# Altium schematic sheet RS232&IrDA.SchDoc
size A4; Revision: B.1(PCB.SCH)
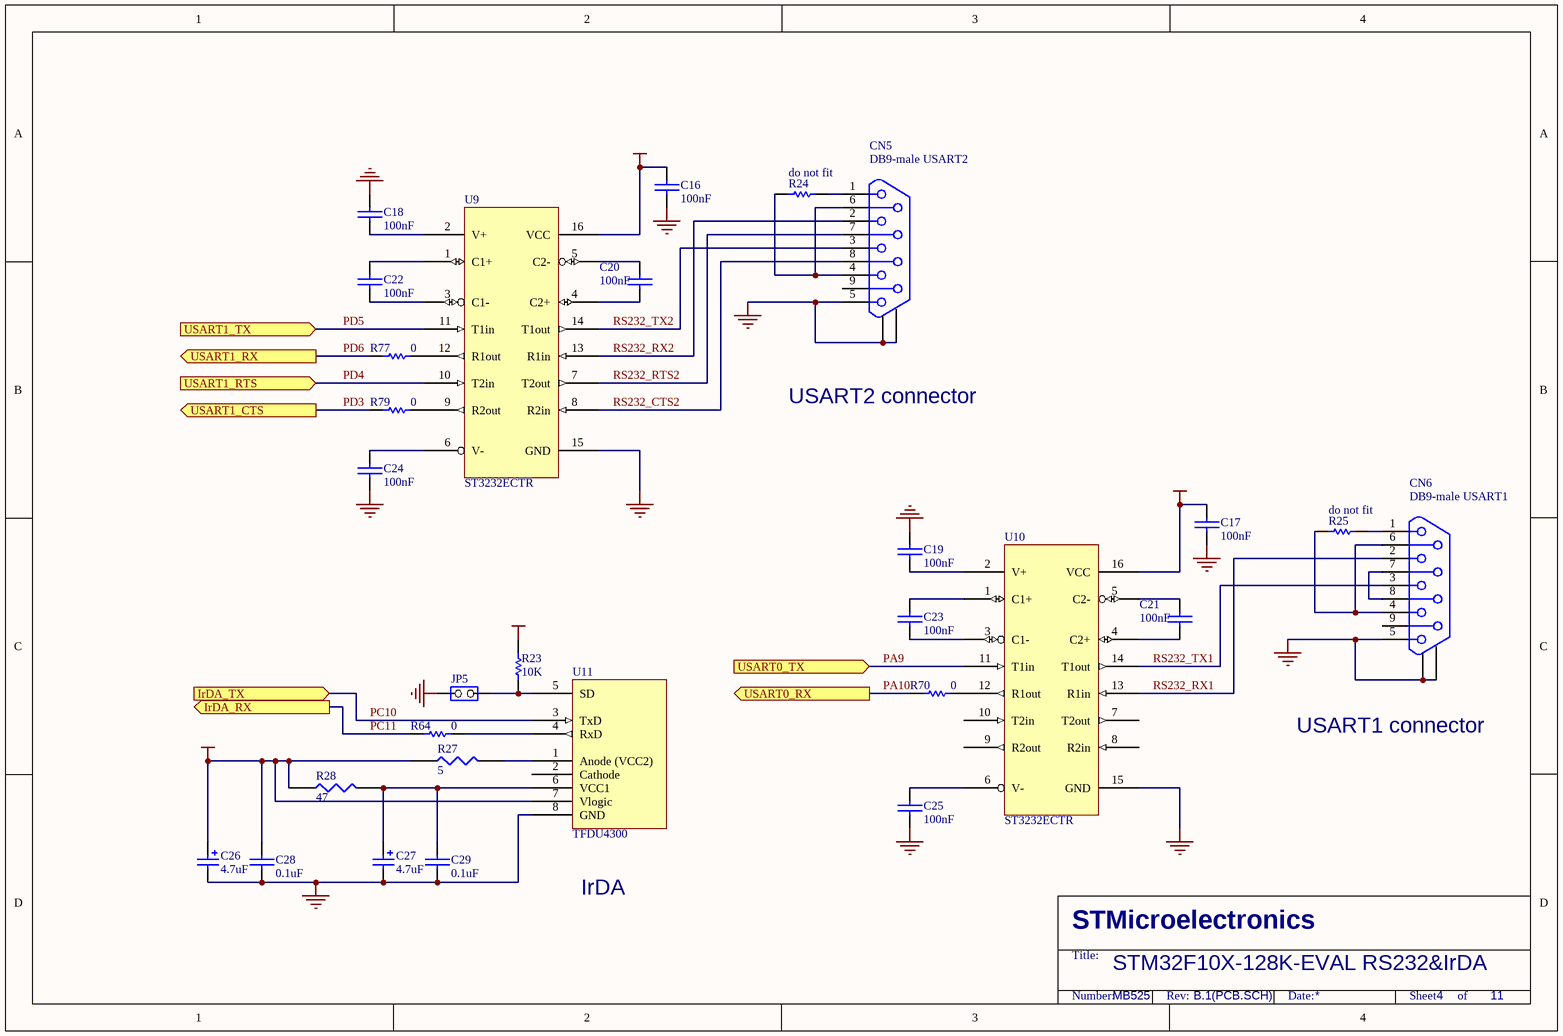
[diagram p0: RS232&IrDA.SchDoc]

## Parts
C16  100nF  [0603P]
C17  100nF  [0603P]
C18  100nF  [0603P]
C19  100nF  [0603P]
C20  100nF  [0603P]
C21  100nF  [0603P]
C22  100nF  [0603P]
C23  100nF  [0603P]
C24  100nF  [0603P]
C25  100nF  [0603P]
C26  4.7uF  [TAN-B]
C27  4.7uF  [TAN-B]
C28  0.1uF  [0603P]
C29  0.1uF  [0603P]
CN5  DB9-male USART2  [DB9/M]
CN6  DB9-male USART1  [DB9/M]
JP5  (no value)  [SIP2]
R23  10K  [0603]
R24  do not fit  [0603_NC]
R25  do not fit  [0603_NC]
R27  5  [0603]
R28  47  [0603]
R64  0  [0805]
R70  0  [0805]
R77  0  [0805]
R79  0  [0805]
U9  ST3232ECTR  [TSSOP16]
U10  ST3232ECTR  [TSSOP16]
U11  TFDU4300  [IR_VISHAY3]

## Ports
IrDA_RX (out), IrDA_TX (in), USART0_RX (out), USART0_TX (in), USART1_CTS (out), USART1_RTS (in), USART1_RX (out), USART1_TX (in)

## Nets
+3V3: C16.1 C17.1 C26.1 C28.1 R23.2 R27.1 R28.1 U9.16(VCC) U10.16(VCC) U11.7(Vlogic)
GND: C16.2 C17.2 C18.1 C19.1 C24.1 C25.1 C26.2 C27.2 C28.2 C29.2 CN5.0 CN5.5 CN6.0 CN6.5 JP5.2(NO) U9.15(GND) U10.15(GND) U11.8(GND)
PA9: U10.11(T1in) ; port USART0_TX
PA10: R70.2 ; port USART0_RX
PC10: U11.3(TxD) ; port IrDA_TX
PC11: R64.2 ; port IrDA_RX
PD3: R79.2 ; port USART1_CTS
PD4: U9.10(T2in) ; port USART1_RTS
PD5: U9.11(T1in) ; port USART1_TX
PD6: R77.2 ; port USART1_RX
RS232_CTS2: CN5.8 U9.8(R2in)
RS232_RTS2: CN5.7 U9.7(T2out)
RS232_RX1: CN6.2 U10.13(R1in)
RS232_RX2: CN5.2 U9.13(R1in)
RS232_TX1: CN6.3 U10.14(T1out)
RS232_TX2: CN5.3 U9.14(T1out)
NetC18_2: C18.2 U9.2(V+)
NetC19_2: C19.2 U10.2(V+)
NetC20_1: C20.1 U9.4(C2+)
NetC20_2: C20.2 U9.5(C2-)
NetC21_1: C21.1 U10.4(C2+)
NetC21_2: C21.2 U10.5(C2-)
NetC22_1: C22.1 U9.1(C1+)
NetC22_2: C22.2 U9.3(C1-)
NetC23_1: C23.1 U10.1(C1+)
NetC23_2: C23.2 U10.3(C1-)
NetC24_2: C24.2 U9.6(V-)
NetC25_2: C25.2 U10.6(V-)
NetC27_1: C27.1 C29.1 R28.2 U11.6(VCC1)
NetCN5_1: CN5.1 R24.2
NetCN5_4: CN5.4 CN5.6 R24.1
NetCN6_1: CN6.1 R25.2
NetCN6_4: CN6.4 CN6.6 R25.1
NetCN6_7: CN6.7 CN6.8
NetJP5_1: JP5.1(COMMON) R23.1 U11.5(SD)
NetR27_2: R27.2 U11.1(Anode_(VCC2))
NetR64_1: R64.1 U11.4(RxD)
NetR70_1: R70.1 U10.12(R1out)
NetR77_1: R77.1 U9.12(R1out)
NetR79_1: R79.1 U9.9(R2out)

Not connected (* = marked no-connect by the designer): CN5 9; CN6 9; U10 7(T2out) 8(R2in) 9(R2out) 10(T2in); U11 2(Cathode)

## Notes on the sheet
- USART2 connector
- USART1 connector
- IrDA
- STM32F10X-128K-EVAL RS232&IrDA
- MB525
- 4
- 11
- STMicroelectronics
- Title:
- Number:
- Rev:
- Date:
- Sheet       of

## Library data of the parts
C16-C25 C28 C29 = CAP: Capacitor
C26 C27 = Cap Pol1: Polarized Capacitor (Radial); Value: 100pF; Published: 8-Jun-2000; Revision: July-2002: Re-released for DXP Platform.; Publisher: Altium Limited
CN5 CN6 = DB9
JP5 = JP2
R23 R64 R70 R77 R79 = Res1: Resistor; Value: 1K; Published: 8-Jun-2000; Revision: July-2002: Re-released for DXP Platform.; Publisher: Altium Limited
R24 R25 = res1: Resistor; Value: 1K; Published: 8-Jun-2000; Revision: July-2002: Re-released for DXP Platform.; Publisher: Altium Limited
R27 R28 = RES1
U9 U10 = ST3232: 3.3V/5V Dual RS232 Transceiver w/ Int. Cap.